# Altium schematic sheet 电池电压检测.SchDoc
size A2
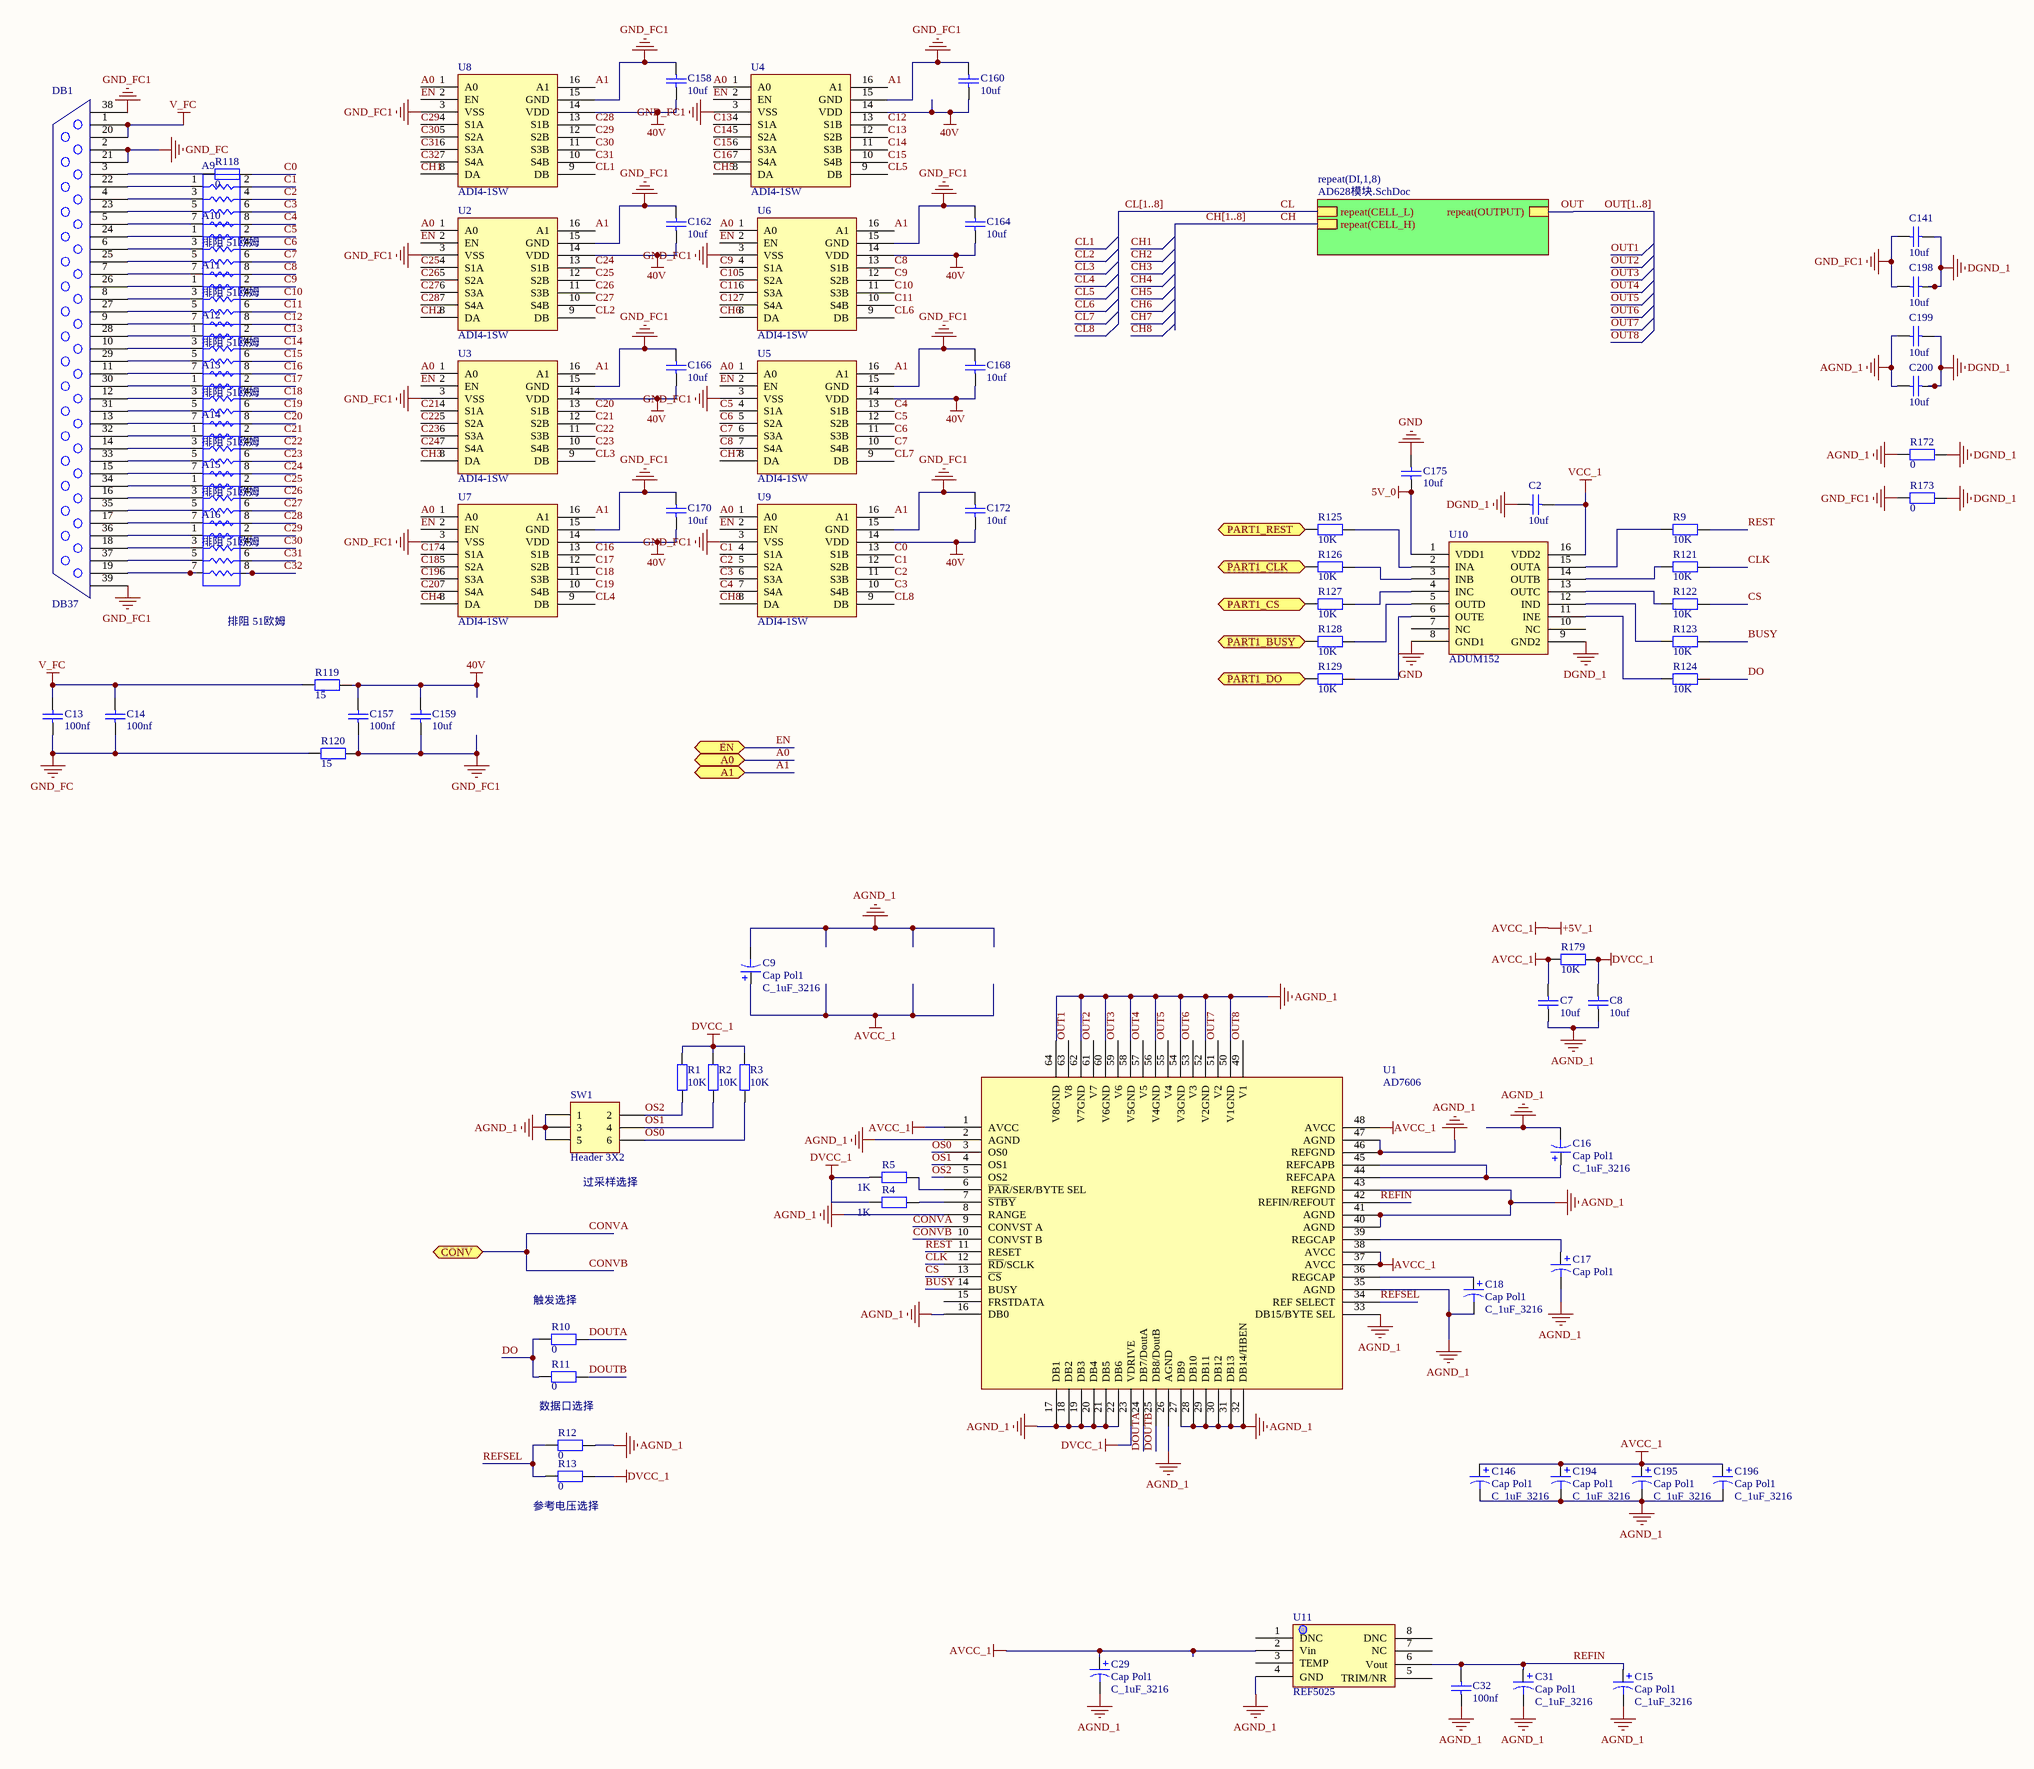
[diagram p0: 电池电压检测.SchDoc]

## Parts
A9  排阻 51欧姆  [RCA03-4D]
A10  排阻 51欧姆  [RCA03-4D]
A11  排阻 51欧姆  [RCA03-4D]
A12  排阻 51欧姆  [RCA03-4D]
A13  排阻 51欧姆  [RCA03-4D]
A14  排阻 51欧姆  [RCA03-4D]
A15  排阻 51欧姆  [RCA03-4D]
A16  排阻 51欧姆  [RCA03-4D]
C2  value 10uf  [0805C]  (hidden comment: Cap)
C7  value 10uf  [0805C]  (hidden comment: Cap)
C8  value 10uf  [0805C]  (hidden comment: Cap)
C9  Cap Pol1  value C_1uF_3216  [3216]
C13  value 100nf  [1812-C]  (hidden comment: Cap)
C14  value 100nf  [1812-C]  (hidden comment: Cap)
C15  Cap Pol1  value C_1uF_3216  [3216]
C16  Cap Pol1  value C_1uF_3216  [3216]
C17  Cap Pol1  [3216]
C18  Cap Pol1  value C_1uF_3216  [3216]
C29  Cap Pol1  value C_1uF_3216  [3216]
C31  Cap Pol1  value C_1uF_3216  [3216]
C32  value 100nf  [0805C]  (hidden comment: Cap)
C141  value 10uf  [0805C]  (hidden comment: Cap)
C146  Cap Pol1  value C_1uF_3216  [3216]
C157  value 100nf  [1812-C]  (hidden comment: Cap)
C158  value 10uf  [0805C]  (hidden comment: Cap)
C159  value 10uf  [0805C]  (hidden comment: Cap)
C160  value 10uf  [0805C]  (hidden comment: Cap)
C162  value 10uf  [0805C]  (hidden comment: Cap)
C164  value 10uf  [0805C]  (hidden comment: Cap)
C166  value 10uf  [0805C]  (hidden comment: Cap)
C168  value 10uf  [0805C]  (hidden comment: Cap)
C170  value 10uf  [0805C]  (hidden comment: Cap)
C172  value 10uf  [0805C]  (hidden comment: Cap)
C175  value 10uf  [0805C]  (hidden comment: Cap)
C194  Cap Pol1  value C_1uF_3216  [3216]
C195  Cap Pol1  value C_1uF_3216  [3216]
C196  Cap Pol1  value C_1uF_3216  [3216]
C198  value 10uf  [0805C]  (hidden comment: Cap)
C199  value 10uf  [0805C]  (hidden comment: Cap)
C200  value 10uf  [0805C]  (hidden comment: Cap)
DB1  DB37  [DB37]
R1  value 10K  [0805R]  (hidden comment: Res2)
R2  value 10K  [0805R]  (hidden comment: Res2)
R3  value 10K  [0805R]  (hidden comment: Res2)
R4  value 1K  [0805R]  (hidden comment: Res2)
R5  value 1K  [0805R]  (hidden comment: Res2)
R9  value 10K  [0805R]  (hidden comment: Res2)
R10  value 0  [0805R]  (hidden comment: Res2)
R11  value 0  [0805R]  (hidden comment: Res2)
R12  value 0  [0805R]  (hidden comment: Res2)
R13  value 0  [0805R]  (hidden comment: Res2)
R118  value 0  [0603AR]  (hidden comment: Res2)
R119  value 15  [0805R]  (hidden comment: Res2)
R120  value 15  [0805R]  (hidden comment: Res2)
R121  value 10K  [0805R]  (hidden comment: Res2)
R122  value 10K  [0805R]  (hidden comment: Res2)
R123  value 10K  [0805R]  (hidden comment: Res2)
R124  value 10K  [0805R]  (hidden comment: Res2)
R125  value 10K  [0805R]  (hidden comment: Res2)
R126  value 10K  [0805R]  (hidden comment: Res2)
R127  value 10K  [0805R]  (hidden comment: Res2)
R128  value 10K  [0805R]  (hidden comment: Res2)
R129  value 10K  [0805R]  (hidden comment: Res2)
R172  value 0  [0805R]  (hidden comment: Res2)
R173  value 0  [0805R]  (hidden comment: Res2)
R179  value 10K  [0805R]  (hidden comment: Res2)
SW1  Header 3X2  [SW_6]
U1  AD7606  [TQFP64]
U2  ADI4-1SW  [TSSOP16]
U3  ADI4-1SW  [TSSOP16]
U4  ADI4-1SW  [TSSOP16]
U5  ADI4-1SW  [TSSOP16]
U6  ADI4-1SW  [TSSOP16]
U7  ADI4-1SW  [TSSOP16]
U8  ADI4-1SW  [TSSOP16]
U9  ADI4-1SW  [TSSOP16]
U10  ADUM152  [SO16NB]
U11  REF5025  [SOP8]

## Sub-sheets
repeat(DI,1,8) = AD628模块.SchDoc: repeat(CELL_L), repeat(CELL_H), repeat(OUTPUT)

## Ports
A0, A1, CONV, EN, PART1_BUSY, PART1_CLK, PART1_CS, PART1_DO, PART1_REST

## Nets
5V_0: C175.2 U10.1(VDD1)
40V: C157.1 C158.1 C159.2 C160.1 C162.1 C164.1 C166.1 C168.1 C170.1 C172.1 R119.2 U2.14(VDD) U3.14(VDD) U4.14(VDD) U5.14(VDD) U6.14(VDD) U7.14(VDD) U8.14(VDD) U9.14(VDD)
+5V_1: C7.2 C9.1 C29.1 C146.1 C194.1 C195.1 C196.1 R179.2 U1.1(AVCC) U1.37(AVCC) U1.38(AVCC) U1.48(AVCC) U11.2(Vin)  [also labelled AVCC_1]
AGND_1: C7.1 C8.1 C9.2 C15.2 C16.2 C17.2 C18.2 C29.2 C31.2 C32.1 C146.2 C194.2 C195.2 C196.2 C199.2 C200.2 R12.1 R172.2 SW1.1 SW1.3 SW1.5 U1.2(AGND) U1.8(RANGE) U1.16(DB0) U1.17(DB1) U1.18(DB2) U1.19(DB3) U1.20(DB4) U1.21(DB5) U1.22(DB6) U1.26(AGND) U1.27(DB9) U1.28(DB10) U1.29(DB11) U1.30(DB12) U1.31(DB13) U1.32(DB14/HBEN) U1.33(DB15/BYTE_SEL) U1.35(AGND) U1.40(AGND) U1.41(AGND) U1.43(REFGND) U1.46(REFGND) U1.47(AGND) U1.50(V1GND) U1.52(V2GND) U1.54(V3GND) U1.56(V4GND) U1.58(V5GND) U1.60(V6GND) U1.62(V7GND) U1.64(V8GND) U11.4(GND)
DGND_1: C2.2 C141.1 C198.1 C199.1 C200.1 R172.1 R173.1 U10.9(GND2)
DVCC_1: C8.2 R1.1 R2.1 R3.1 R4.2 R5.2 R13.1 R179.1 U1.23(VDRIVE)
GND: C175.1 U10.8(GND1)
GND_FC: C13.2 C14.2 DB1.2 DB1.21 R120.1
GND_FC1: C141.2 C157.2 C158.2 C159.1 C160.2 C162.2 C164.2 C166.2 C168.2 C170.2 C172.2 C198.2 DB1.38 DB1.39 R120.2 R173.2 U2.3(VSS) U2.15(GND) U3.3(VSS) U3.15(GND) U4.3(VSS) U4.15(GND) U5.3(VSS) U5.15(GND) U6.3(VSS) U6.15(GND) U7.3(VSS) U7.15(GND) U8.3(VSS) U8.15(GND) U9.3(VSS) U9.15(GND)
V_FC: C13.1 C14.1 DB1.1 DB1.20 R119.1
VCC_1: C2.1 U10.16(VDD2)
A0: U2.1(A0) U3.1(A0) U4.1(A0) U5.1(A0) U6.1(A0) U7.1(A0) U8.1(A0) U9.1(A0) ; port A0
A1: U2.16(A1) U3.16(A1) U4.16(A1) U5.16(A1) U6.16(A1) U7.16(A1) U8.16(A1) U9.16(A1) ; port A1
BUSY: R123.1 U1.14(BUSY)
C0: R118.1 U9.13(S1B)
C1: A9.2 U9.4(S1A) U9.12(S2B)
C2: A9.4 U9.5(S2A) U9.11(S3B)
C3: A9.6 U9.6(S3A) U9.10(S4B)
C4: A9.8 U5.13(S1B) U9.7(S4A)
C5: A10.2 U5.4(S1A) U5.12(S2B)
C6: A10.4 U5.5(S2A) U5.11(S3B)
C7: A10.6 U5.6(S3A) U5.10(S4B)
C8: A10.8 U5.7(S4A) U6.13(S1B)
C9: A11.2 U6.4(S1A) U6.12(S2B)
C10: A11.4 U6.5(S2A) U6.11(S3B)
C11: A11.6 U6.6(S3A) U6.10(S4B)
C12: A11.8 U4.13(S1B) U6.7(S4A)
C13: A12.2 U4.4(S1A) U4.12(S2B)
C14: A12.4 U4.5(S2A) U4.11(S3B)
C15: A12.6 U4.6(S3A) U4.10(S4B)
C16: A12.8 U4.7(S4A) U7.13(S1B)
C17: A13.2 U7.4(S1A) U7.12(S2B)
C18: A13.4 U7.5(S2A) U7.11(S3B)
C19: A13.6 U7.6(S3A) U7.10(S4B)
C20: A13.8 U3.13(S1B) U7.7(S4A)
C21: A14.2 U3.4(S1A) U3.12(S2B)
C22: A14.4 U3.5(S2A) U3.11(S3B)
C23: A14.6 U3.6(S3A) U3.10(S4B)
C24: A14.8 U2.13(S1B) U3.7(S4A)
C25: A15.2 U2.4(S1A) U2.12(S2B)
C26: A15.4 U2.5(S2A) U2.11(S3B)
C27: A15.6 U2.6(S3A) U2.10(S4B)
C28: A15.8 U2.7(S4A) U8.13(S1B)
C29: A16.2 U8.4(S1A) U8.12(S2B)
C30: A16.4 U8.5(S2A) U8.11(S3B)
C31: A16.6 U8.6(S3A) U8.10(S4B)
C32: A16.8 U8.7(S4A)
CH: sheet repeat(DI,1,8)/repeat(CELL_H)
CH1: U8.8(DA)
CH2: U2.8(DA)
CH3: U3.8(DA)
CH4: U7.8(DA)
CH5: U4.8(DA)
CH6: U6.8(DA)
CH7: U5.8(DA)
CH8: U9.8(DA)
CL: sheet repeat(DI,1,8)/repeat(CELL_L)
CL1: U8.9(DB)
CL2: U2.9(DB)
CL3: U3.9(DB)
CL4: U7.9(DB)
CL5: U4.9(DB)
CL6: U6.9(DB)
CL7: U5.9(DB)
CL8: U9.9(DB)
CLK: R121.1 U1.12(~{RD}/SCLK)
CONVA: U1.9(CONVST_A) U1.10(CONVST_B) ; port CONV  [also labelled CONVB]
CS: R122.1 U1.13(~{CS})
DO: R10.1 R11.1 R124.1
DOUTA: R10.2 U1.24(DB7/DoutA)
DOUTB: R11.2 U1.25(DB8/DoutB)
EN: U2.2(EN) U3.2(EN) U4.2(EN) U5.2(EN) U6.2(EN) U7.2(EN) U8.2(EN) U9.2(EN) ; port EN
OS0: R3.2 SW1.6 U1.3(OS0)
OS1: R2.2 SW1.4 U1.4(OS1)
OS2: R1.2 SW1.2 U1.5(OS2)
OUT: sheet repeat(DI,1,8)/repeat(OUTPUT)
OUT1: U1.63(V8)
OUT2: U1.61(V7)
OUT3: U1.59(V6)
OUT4: U1.57(V5)
OUT5: U1.55(V4)
OUT6: U1.53(V3)
OUT7: U1.51(V2)
OUT8: U1.49(V1)
PART1_BUSY: R128.2 ; port PART1_BUSY
PART1_CLK: R126.2 ; port PART1_CLK
PART1_CS: R127.2 ; port PART1_CS
PART1_DO: R129.2 ; port PART1_DO
PART1_REST: R125.2 ; port PART1_REST
REFIN: C15.1 C31.1 C32.2 U1.42(REFIN/REFOUT) U11.6(Vout)
REFSEL: R12.2 R13.2 U1.34(REF_SELECT)
REST: R9.1 U1.11(RESET)
NetA9_1: A9.1 DB1.22
NetA9_3: A9.3 DB1.4
NetA9_5: A9.5 DB1.23
NetA9_7: A9.7 DB1.5
NetA10_1: A10.1 DB1.24
NetA10_3: A10.3 DB1.6
NetA10_5: A10.5 DB1.25
NetA10_7: A10.7 DB1.7
NetA11_1: A11.1 DB1.26
NetA11_3: A11.3 DB1.8
NetA11_5: A11.5 DB1.27
NetA11_7: A11.7 DB1.9
NetA12_1: A12.1 DB1.28
NetA12_3: A12.3 DB1.10
NetA12_5: A12.5 DB1.29
NetA12_7: A12.7 DB1.11
NetA13_1: A13.1 DB1.30
NetA13_3: A13.3 DB1.12
NetA13_5: A13.5 DB1.31
NetA13_7: A13.7 DB1.13
NetA14_1: A14.1 DB1.32
NetA14_3: A14.3 DB1.14
NetA14_5: A14.5 DB1.33
NetA14_7: A14.7 DB1.15
NetA15_1: A15.1 DB1.34
NetA15_3: A15.3 DB1.16
NetA15_5: A15.5 DB1.35
NetA15_7: A15.7 DB1.17
NetA16_1: A16.1 DB1.36
NetA16_3: A16.3 DB1.18
NetA16_5: A16.5 DB1.37
NetA16_7: A16.7 DB1.19
NetC16_1: C16.1 U1.44(REFCAPA) U1.45(REFCAPB)
NetC17_1: C17.1 U1.39(REGCAP)
NetC18_1: C18.1 U1.36(REGCAP)
NetDB1_3: DB1.3 R118.2
NetR4_1: R4.1 U1.7(~{STBY})
NetR5_1: R5.1 U1.6(~{PAR}/SER/BYTE_SEL)
NetR9_2: R9.2 U10.15(OUTA)
NetR121_2: R121.2 U10.14(OUTB)
NetR122_2: R122.2 U10.13(OUTC)
NetR123_2: R123.2 U10.12(IND)
NetR124_2: R124.2 U10.11(INE)
NetR125_1: R125.1 U10.2(INA)
NetR126_1: R126.1 U10.3(INB)
NetR127_1: R127.1 U10.4(INC)
NetR128_1: R128.1 U10.5(OUTD)
NetR129_1: R129.1 U10.6(OUTE)

Not connected (* = marked no-connect by the designer): U1 15(FRSTDATA); U10 7(NC) 10(NC); U11 1(DNC) 3(TEMP) 5(TRIM/NR) 7(NC) 8(DNC)

## Buses and harness runs
bus CH[1..8]
bus CL[1..8]
bus OUT[1..8]

## Notes on the sheet
- (near SW1) 过采样选择
- (near R10) 触发选择
- 数据口选择
- (near R13) 参考电压选择

## Library data of the parts
A9-A16 = RESPACK5
C2 C7 C8 C13 C14 C32 C141 C157-C160 C162 C164 C166 C168 C170 C172 C175 C198-C200 = Cap: Capacitor; Published: 8-Jun-2000; LatestRevisionDate: 17-Jul-2002; LatestRevisionNote: Re-released for DXP Platform.; PackageReference: RAD-0.3; Publisher: Altium Limited; PackageDescription: Radial Cap, Thru-Hole; 2 Leads; 0.3 in Pin Spacing
C9 C15-C18 C29 C31 C146 C194-C196 = Cap Pol1: Polarized Capacitor (Radial); Published: 8-Jun-2000; LatestRevisionDate: 17-Jul-2002; LatestRevisionNote: Re-released for DXP Platform.; PackageReference: RB7.6-15; Publisher: Altium Limited
R1-R5 R9-R13 R118-R129 R172 R173 R179 = Res2: Resistor; Published: 8-Jun-2000; LatestRevisionDate: 17-Jul-2002; LatestRevisionNote: Re-released for DXP Platform.; PackageReference: AXIAL-0.4; Publisher: Altium Limited; PackageDescription: Axial Device, Thru-Hole; 2 Leads; 0.4 in Pin Spacing
SW1 = Header 3X2: Header, 3-Pin, Dual row; LatestRevisionDate: 17-Jul-2002; LatestRevisionNote: Re-released for DXP Platform.; Publisher: Altium Limited